# Altium schematic sheet E-15 ENET2.SchDoc: FRDM-IMX93
size 513 x 386 mm; DrawnBy: FORLINX; Organization: ORGANIZATION; Address1: ADDRESS 1; Address2: ADDRESS 2; Address3: ADDRESS 3; Address4: ADDRESS 4; Revision: -; ENG_APP_DATE: --/--/--; DSN_APP_DATE: --/--/--; CHK_APP_DATE: --/--/--; Classification: Public, Company Internal/Proprietary, Company Confidential,  Company Secret; Page Create Date: March  8, 1995; OrgName: NXP Semiconductor; FIUO: A; OrgAddr1: NO. 192 Liangjing Rd. Pudong New Area, ShangHai; Page Number: 15; PageTitle: ENET2; Page Size: C; Page Count: 23; Designer: FORLINX; RevCode: B1; Approver: NXP SE; Doc: SCH-94611 PDF: SPF-94611; DsnPath: T:\FILES\Designs\Single Board Computers\i.MX93-FRDM\Design Files\SCH-94611_B1.DSN; SchematicName: FRDM-i.MX 93 Development Board; PageName: E-15 ENET2; PageSize: C; TopSchematic: True
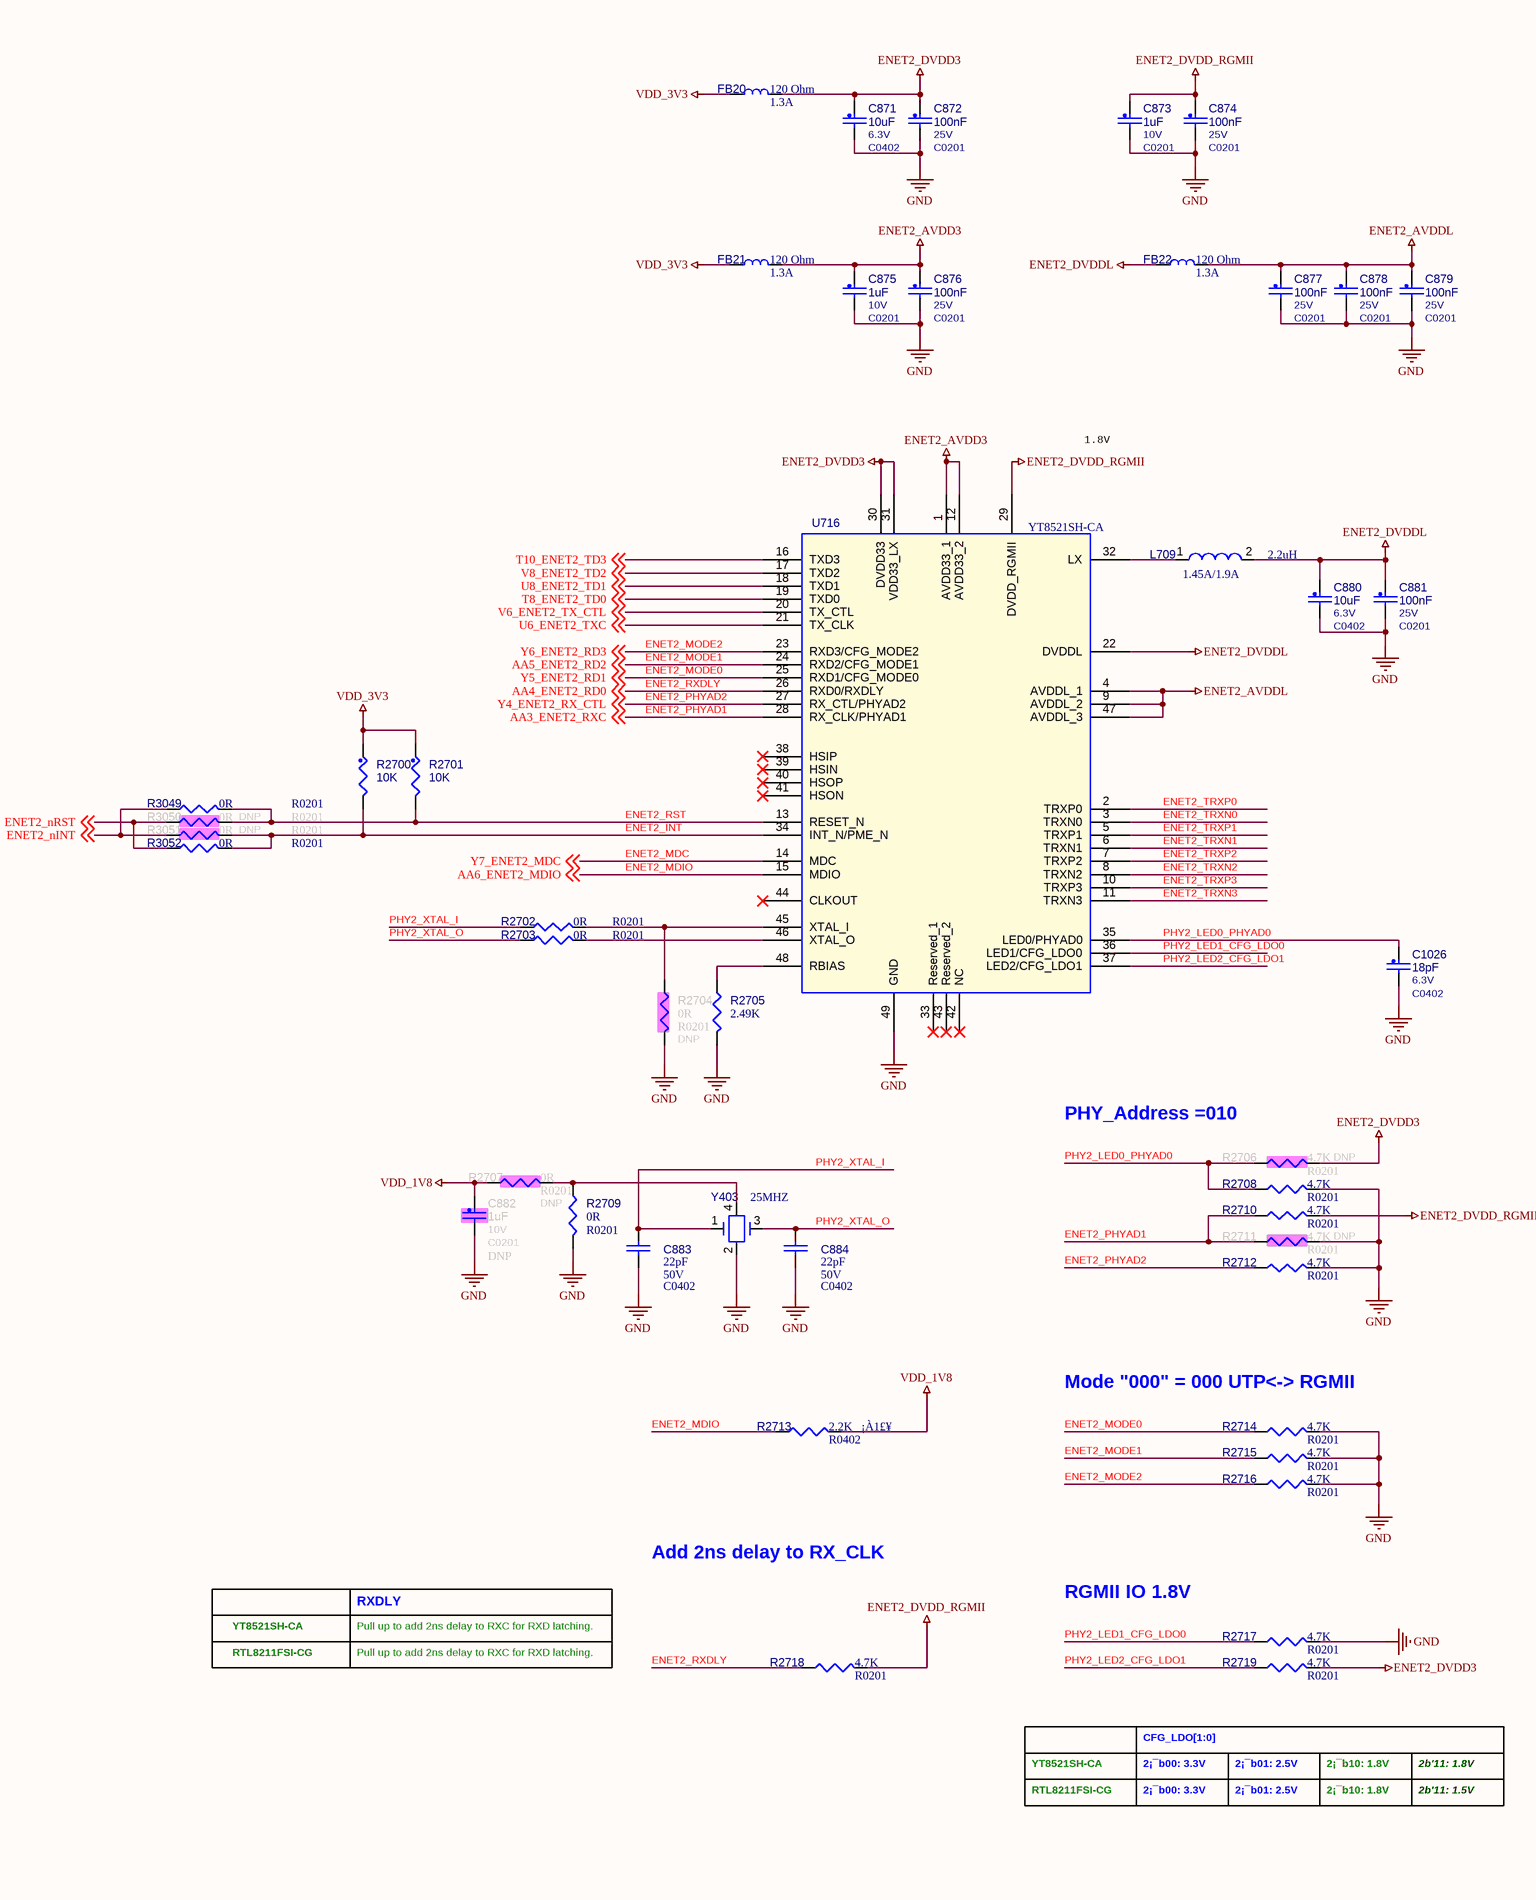
[diagram p0: E-15 ENET2.SchDoc, left]
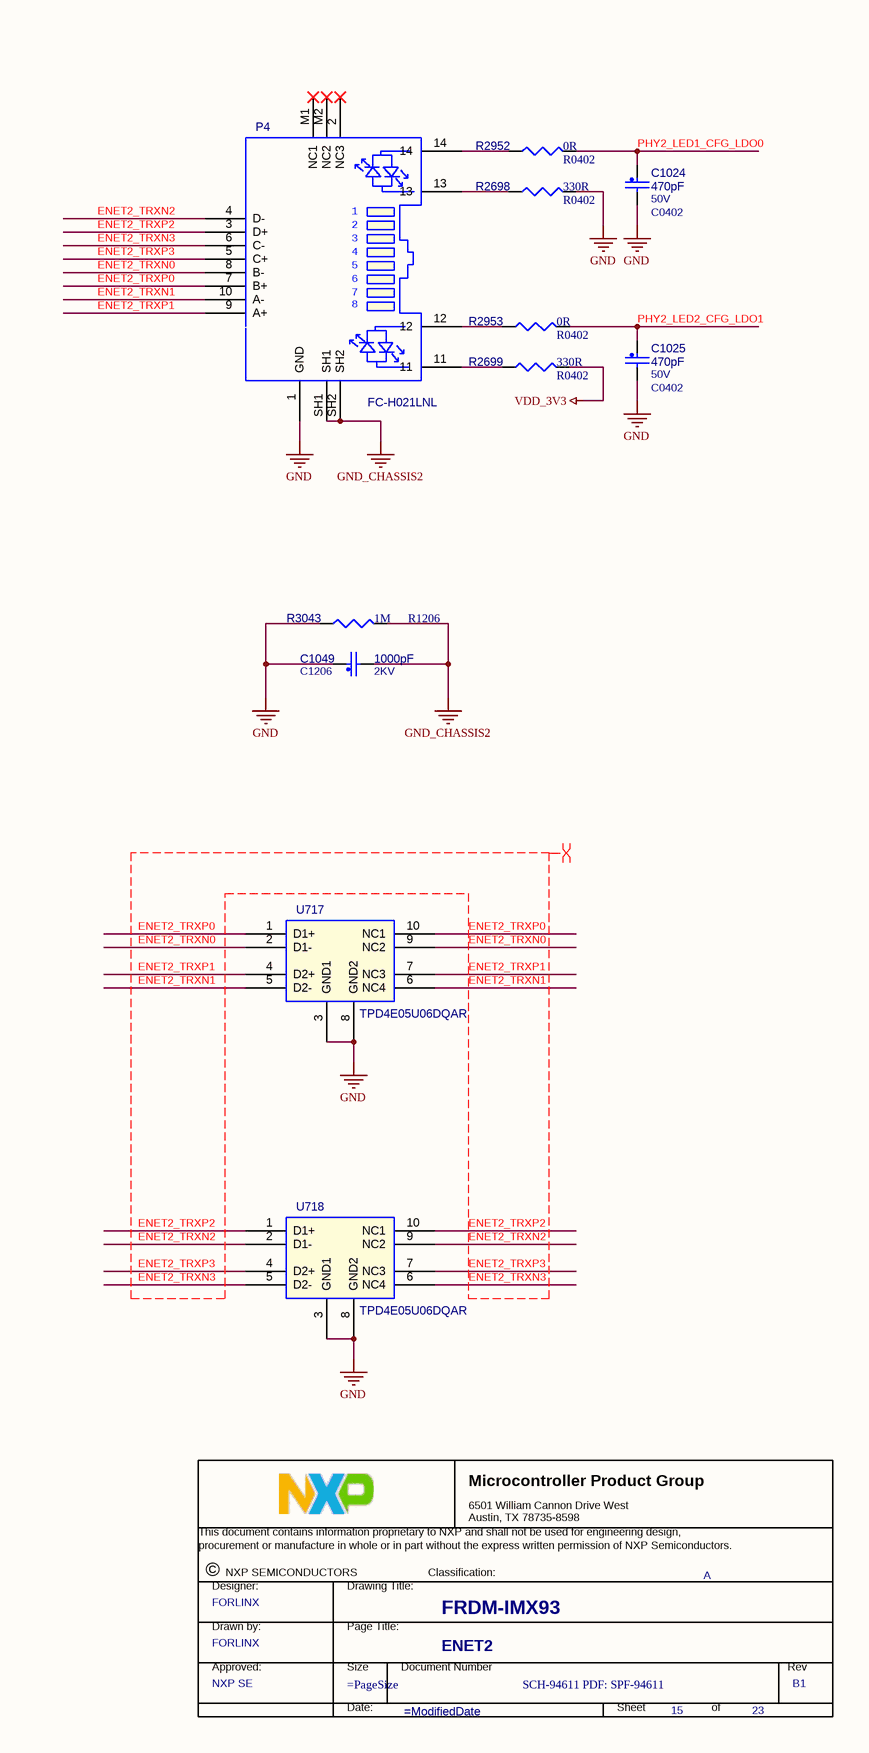
[diagram p1: E-15 ENET2.SchDoc, right]

## Parts
*  Title: FRDM-IMX93  RevCode: B1  PageTitle: ENET2  Page Number: 15  Page Count: 23  DrawnBy: FORLINX  Doc: SCH-94611 PDF: SPF-94611  Approver: NXP SE  FIUO: A  (graphical)
C871  10uF  VOLTAGE: 6.3V  [C0402]
C872  100nF  VOLTAGE: 25V  [C0201]
C873  1uF  VOLTAGE: 10V  [C0201]
C874  100nF  VOLTAGE: 25V  [C0201]
C875  1uF  VOLTAGE: 10V  [C0201]
C876  100nF  VOLTAGE: 25V  [C0201]
C877  100nF  VOLTAGE: 25V  [C0201]
C878  100nF  VOLTAGE: 25V  [C0201]
C879  100nF  VOLTAGE: 25V  [C0201]
C880  10uF  VOLTAGE: 6.3V  [C0402]
C881  100nF  VOLTAGE: 25V  [C0201]
C882  1uF  ASSY_OPT: DNP  VOLTAGE: 10V  [C0201]
C883  22pF  Voltage: 50V  [C0402]
C884  22pF  Voltage: 50V  [C0402]
C1024  470pF  VOLTAGE: 50V  [C0402]
C1025  470pF  VOLTAGE: 50V  [C0402]
C1026  18pF  VOLTAGE: 6.3V  [C0402]
C1049  1000pF  VOLTAGE: 2KV  [C1206]
FB20  120 Ohm  electric current: 1.3A  [FB0402]
FB21  120 Ohm  electric current: 1.3A  [FB0402]
FB22  120 Ohm  electric current: 1.3A  [FB0402]
L709  2.2uH  electric current: 1.45A/1.9A  [IND_2016A]
P4  FC-H021LNL  [RJ45-Gigabit]
R2698  330R  [R0402]
R2699  330R  [R0402]
R2700  10K  [R0201]
R2701  10K  [R0201]
R2702  0R  [R0201]
R2703  0R  [R0201]
R2704  0R  ASSY_OPT: DNP  [R0201]
R2705  2.49K  [R0402]
R2706  4.7K  ASSY_OPT: DNP  [R0201]
R2707  0R  ASSY_OPT: DNP  [R0201]
R2708  4.7K  [R0201]
R2709  0R  [R0201]
R2710  4.7K  [R0201]
R2711  4.7K  ASSY_OPT: DNP  [R0201]
R2712  4.7K  [R0201]
R2713  2.2K  precision: ¡À1£¥  [R0402]
R2714  4.7K  [R0201]
R2715  4.7K  [R0201]
R2716  4.7K  [R0201]
R2717  4.7K  [R0201]
R2718  4.7K  [R0201]
R2719  4.7K  [R0201]
R2952  0R  [R0402]
R2953  0R  [R0402]
R3043  1M  [R1206]
R3049  0R  [R0201]
R3050  0R  ASSY_OPT: DNP  [R0201]
R3051  0R  ASSY_OPT: DNP  [R0201]
R3052  0R  [R0201]
U716  YT8521SH-CA  [QFN48P_0_4BSC_6x6_H]
U717  TPD4E05U06DQAR  [USON-10]
U718  TPD4E05U06DQAR  [USON-10]
Y403  25MHZ  [xtlosc4_3p2x2p5mm_sm]

## Nets
ENET2_AVDD3: C875.1 C876.1 FB21.2 U716.1(AVDD33_1) U716.12(AVDD33_2)
ENET2_AVDDL: C877.1 C878.1 C879.1 FB22.2 U716.4(AVDDL_1) U716.9(AVDDL_2) U716.47(AVDDL_3)
ENET2_DVDD3: C871.1 C872.1 FB20.2 R2706.2 R2719.2 U716.30(DVDD33) U716.31(VDD33_LX)
ENET2_DVDD_RGMII: C873.1 C874.1 R2710.2 R2718.2 U716.29(DVDD_RGMII)
ENET2_DVDDL: C880.1 C881.1 FB22.1 L709.2 U716.22(DVDDL)
GND: C871.2 C872.2 C873.2 C874.2 C875.2 C876.2 C877.2 C878.2 C879.2 C880.2 C881.2 C882.2 C883.2 C884.2 C1024.2 C1025.2 C1026.2 C1049.1 P4.1(GND) R2698.2 R2704.2 R2705.2 R2708.2 R2709.2 R2711.2 R2712.2 R2714.2 R2715.2 R2716.2 R2717.2 R3043.1 U716.49(GND) U717.3(GND1) U717.8(GND2) U718.3(GND1) U718.8(GND2) Y403.2
GND_CHASSIS2: C1049.2 P4.SH1 P4.SH2 R3043.2
VDD_1V8: C882.1 R2707.1 R2713.2
VDD_3V3: FB20.1 FB21.1 R2699.2 R2700.1 R2701.1
ENET2_INT: R2700.2 R3051.2 R3052.2 U716.34(INT_N/PME_N)
ENET2_MDC: U716.14(MDC) ; off-sheet Y7_ENET2_MDC  [also labelled Y7_ENET2_MDC]
ENET2_MDIO: R2713.1 U716.15(MDIO) ; off-sheet AA6_ENET2_MDIO  [also labelled AA6_ENET2_MDIO]
ENET2_MODE0: R2714.1 U716.25(RXD1/CFG_MODE0) ; off-sheet Y5_ENET2_RD1  [also labelled Y5_ENET2_RD1]
ENET2_MODE1: R2715.1 U716.24(RXD2/CFG_MODE1) ; off-sheet AA5_ENET2_RD2  [also labelled AA5_ENET2_RD2]
ENET2_MODE2: R2716.1 U716.23(RXD3/CFG_MODE2) ; off-sheet Y6_ENET2_RD3  [also labelled Y6_ENET2_RD3]
ENET2_nINT: R3049.1 R3051.1 ; off-sheet ENET2_nINT
ENET2_nRST: R3050.1 R3052.1 ; off-sheet ENET2_nRST
ENET2_PHYAD1: R2710.1 R2711.1 U716.28(RX_CLK/PHYAD1) ; off-sheet AA3_ENET2_RXC  [also labelled AA3_ENET2_RXC]
ENET2_PHYAD2: R2712.1 U716.27(RX_CTL/PHYAD2) ; off-sheet Y4_ENET2_RX_CTL  [also labelled Y4_ENET2_RX_CTL]
ENET2_RST: R2701.2 R3049.2 R3050.2 U716.13(RESET_N)
ENET2_RXDLY: R2718.1 U716.26(RXD0/RXDLY) ; off-sheet AA4_ENET2_RD0  [also labelled AA4_ENET2_RD0]
ENET2_TRXN0: P4.8(B-) U716.3(TRXN0) U717.2(D1-) U717.9(NC2)
ENET2_TRXN1: P4.10(A-) U716.6(TRXN1) U717.5(D2-) U717.6(NC4)
ENET2_TRXN2: P4.4(D-) U716.8(TRXN2) U718.2(D1-) U718.9(NC2)
ENET2_TRXN3: P4.6(C-) U716.11(TRXN3) U718.5(D2-) U718.6(NC4)
ENET2_TRXP0: P4.7(B+) U716.2(TRXP0) U717.1(D1+) U717.10(NC1)
ENET2_TRXP1: P4.9(A+) U716.5(TRXP1) U717.4(D2+) U717.7(NC3)
ENET2_TRXP2: P4.3(D+) U716.7(TRXP2) U718.1(D1+) U718.10(NC1)
ENET2_TRXP3: P4.5(C+) U716.10(TRXP3) U718.4(D2+) U718.7(NC3)
PHY2_LED0_PHYAD0: C1026.1 R2706.1 R2708.1 U716.35(LED0/PHYAD0)
PHY2_LED1_CFG_LDO0: C1024.1 R2717.1 R2952.2 U716.36(LED1/CFG_LDO0)
PHY2_LED2_CFG_LDO1: C1025.1 R2719.1 R2953.2 U716.37(LED2/CFG_LDO1)
PHY2_XTAL_I: C883.1 R2702.1 Y403.1
PHY2_XTAL_O: C884.1 R2703.1 Y403.3
T8_ENET2_TD0: U716.19(TXD0) ; off-sheet T8_ENET2_TD0
T10_ENET2_TD3: U716.16(TXD3) ; off-sheet T10_ENET2_TD3
U6_ENET2_TXC: U716.21(TX_CLK) ; off-sheet U6_ENET2_TXC
U8_ENET2_TD1: U716.18(TXD1) ; off-sheet U8_ENET2_TD1
V6_ENET2_TX_CTL: U716.20(TX_CTL) ; off-sheet V6_ENET2_TX_CTL
V8_ENET2_TD2: U716.17(TXD2) ; off-sheet V8_ENET2_TD2
NetL709_1: L709.1 U716.32(LX)
NetP4_11: P4.11 R2699.1
NetP4_12: P4.12 R2953.1
NetP4_13: P4.13 R2698.1
NetP4_14: P4.14 R2952.1
NetR2702_2: R2702.2 R2704.1 U716.45(XTAL_I)
NetR2703_2: R2703.2 U716.46(XTAL_O)
NetR2705_1: R2705.1 U716.48(RBIAS)
NetR2707_2: R2707.2 R2709.1 Y403.4

Not connected (* = marked no-connect by the designer): P4 2(NC3)* M1(NC1)* M2(NC2)*; U716 33(Reserved_1)* 38(HSIP)* 39(HSIN)* 40(HSOP)* 41(HSON)* 42(NC)* 43(Reserved_2)* 44(CLKOUT)*

## Layout directives
differential pair: ENET2_TRXN0, ENET2_TRXN1, ENET2_TRXN2, ENET2_TRXN3, ENET2_TRXP0, ENET2_TRXP1, ENET2_TRXP2, ENET2_TRXP3

## Notes on the sheet
- 1.8V
- PHY_Address =010
- (near R2714) Mode "000" = 000 UTP<-> RGMII
- Add 2ns delay to RX_CLK
- YT8521SH-CA
- Pull up to add 2ns delay to RXC for RXD latching.
- RXDLY
- RGMII IO 1.8V
- RTL8211FSI-CG
- 2¡¯b00: 3.3V
- CFG_LDO[1:0]
- 2¡¯b01: 2.5V
- 2¡¯b10: 1.8V
- 2b'11: 1.8V
- 2b'11: 1.5V
- DWG. NO.
- REV.
- SHT.
- REVISION
- DESCRIPTION
- DATE
- APPROVED
- ENG:
- APPROVALS
- quilter.ai <http://quilter.ai>
- DSN:
- CHK:
- REFERENCE DOCUMENTS
- TITLE
- PROJECT
- BOM:
- FAB DWG:
- PCB DWG:
- ASSY DWG:
- SIZE
- FILE NAME
- C
- DWG NO.
- SHEET
- OF
- REV
- (in symbol TitleBlock_MCPG) Microcontroller Product Group; 6501 William Cannon Drive West / Austin, TX 78735-8598; This document contains information proprietary to NXP and shall not be used for engineering design,; procurement or manufacture in whole or in part without the express written permission of NXP Semiconductors.; ©; NXP SEMICONDUCTORS; Classification:; Designer:; Drawing Title:; Drawn by:; Page Title:; Approved:; Size; Document Number; Rev; Date:; Sheet; of

## Library data of the parts
* = TitleBlock_MCPG: Classification: Public, Company Internal/Proprietary, Company Confidential,  Company Secret; OrgName: NXP Semiconductor; OrgAddr1: NO. 192 Liangjing Rd. Pudong New Area, ShangHai; Page Size: =PageSize; Page Create Date: March  8, 1995; Designer: FORLINX; Page Modify Date: =ModifiedDate
C871 = CAP_NP: 0402,10uF,6.3V,+/-20%,X5R; Part Reference: C871; CLASS: DISCRETE; Tolerance: 20%; MFG_NAME01: FENGHUA; MFG_PN01: 0402X106M6R3NT; CAD_APPROVED: Yes; FPLIST: CC0402_25,CC0402_HD,0402_CC; Value: 10uF; ROHS: Yes; HEIGHT: 0.65 MM; PCB Footprint: C0402
C872 = CAP_NP: 0201,100nF,25V,+/-10%,X5R; Part Reference: C872; CLASS: DISCRETE; FPLIST: CC0402_25,CC0402_HD,0402_CC; CAD_APPROVED: Yes; MFG_PN01: 0201X104K250NT; MFG_NAME01: FENGHUA; Tolerance: 20%; Value: 100nF; HEIGHT: 0.65 MM; ROHS: Yes; PCB Footprint: C0201
C873 = CAP_NP: 0201,1uF,10V,+/-20%,X5R; Part Reference: C873; CLASS: DISCRETE; FPLIST: CC0201,CC0201_HD,0201_CC,0201_CC_012SM_NSP; CAD_APPROVED: Yes; MFG_PN01: CL03A105MP3NSNC; MFG_NAME01: SAMSUNG; Tolerance: 20%; Value: 1uF; Package Type: 7¡± reel; Package Size: 0201; HEIGHT: 0.35MM; ROHS: Yes; PCB Footprint: C0201
C874 = CAP_NP: 0201,100nF,25V,+/-10%,X5R; Part Reference: C874; CLASS: DISCRETE; Tolerance: 20%; MFG_NAME01: FENGHUA; MFG_PN01: 0201X104K250NT; CAD_APPROVED: Yes; FPLIST: CC0402_25,CC0402_HD,0402_CC; Value: 100nF; ROHS: Yes; HEIGHT: 0.65 MM; PCB Footprint: C0201
C875 = CAP_NP: 0201,1uF,10V,+/-20%,X5R; Part Reference: C875; CLASS: DISCRETE; Tolerance: 20%; MFG_NAME01: SAMSUNG; MFG_PN01: CL03A105MP3NSNC; CAD_APPROVED: Yes; FPLIST: CC0201,CC0201_HD,0201_CC,0201_CC_012SM_NSP; Value: 1uF; ROHS: Yes; HEIGHT: 0.35MM; Package Size: 0201; Package Type: 7¡± reel; PCB Footprint: C0201
C876 = CAP_NP: 0201,100nF,25V,+/-10%,X5R; Part Reference: C876; CLASS: DISCRETE; FPLIST: CC0402_25,CC0402_HD,0402_CC; CAD_APPROVED: Yes; MFG_PN01: 0201X104K250NT; MFG_NAME01: FENGHUA; Tolerance: 20%; Value: 100nF; HEIGHT: 0.65 MM; ROHS: Yes; PCB Footprint: C0201
C877 = CAP_NP: 0201,100nF,25V,+/-10%,X5R; Part Reference: C877; CLASS: DISCRETE; FPLIST: CC0402_25,CC0402_HD,0402_CC; CAD_APPROVED: Yes; MFG_PN01: 0201X104K250NT; MFG_NAME01: FENGHUA; Tolerance: 20%; Value: 100nF; HEIGHT: 0.65 MM; ROHS: Yes; PCB Footprint: C0201
C878 = CAP_NP: 0201,100nF,25V,+/-10%,X5R; Part Reference: C878; CLASS: DISCRETE; FPLIST: CC0402_25,CC0402_HD,0402_CC; CAD_APPROVED: Yes; MFG_PN01: 0201X104K250NT; MFG_NAME01: FENGHUA; Tolerance: 20%; Value: 100nF; HEIGHT: 0.65 MM; ROHS: Yes; PCB Footprint: C0201
C879 = CAP_NP: 0201,100nF,25V,+/-10%,X5R; Part Reference: C879; CLASS: DISCRETE; Tolerance: 20%; MFG_NAME01: FENGHUA; MFG_PN01: 0201X104K250NT; CAD_APPROVED: Yes; FPLIST: CC0402_25,CC0402_HD,0402_CC; Value: 100nF; ROHS: Yes; HEIGHT: 0.65 MM; PCB Footprint: C0201
C880 = CAP_NP: 0402,10uF,6.3V,+/-20%,X5R; Part Reference: C880; CLASS: DISCRETE; Tolerance: 20%; MFG_NAME01: FENGHUA; MFG_PN01: 0402X106M6R3NT; CAD_APPROVED: Yes; FPLIST: CC0402_25,CC0402_HD,0402_CC; Value: 10uF; ROHS: Yes; HEIGHT: 0.65 MM; PCB Footprint: C0402
C881 = CAP_NP: 0201,100nF,25V,+/-10%,X5R; Part Reference: C881; CLASS: DISCRETE; Tolerance: 20%; MFG_NAME01: FENGHUA; MFG_PN01: 0201X104K250NT; CAD_APPROVED: Yes; FPLIST: CC0402_25,CC0402_HD,0402_CC; Value: 100nF; ROHS: Yes; HEIGHT: 0.65 MM; PCB Footprint: C0201
C882 = CAP_NP: 0201,1uF,10V,+/-20%,X5R; Part Reference: C882; CLASS: DISCRETE; Tolerance: 20%; MFG_NAME01: SAMSUNG; MFG_PN01: CL03A105MP3NSNC; CAD_APPROVED: Yes; FPLIST: CC0201,CC0201_HD,0201_CC,0201_CC_012SM_NSP; Value: 1uF; ROHS: Yes; HEIGHT: 0.35MM; Package Size: 0201; Package Type: 7¡± reel; PCB Footprint: C0201
C883 = C0402,22pF: 0402,22pF,50V,+/-5%,NPO; Part Reference: C883; serial number: 1110202003; MFG_NAME01: FENGHUA; MFG_PN01: 0402CG220J500NT; PCB Footprint: C0402; Value: 22pF
C884 = C0402,22pF: 0402,22pF,50V,+/-5%,NPO; Part Reference: C884; serial number: 1110202003; MFG_NAME01: FENGHUA; MFG_PN01: 0402CG220J500NT; PCB Footprint: C0402; Value: 22pF
C1024 = CAP_NP: 0402,470pF,50V,+/-5%,NPO; Part Reference: C1024; CLASS: DISCRETE; Tolerance: 20%; MFG_NAME01: FENGHUA; MFG_PN01: 0402CG471J500NT; CAD_APPROVED: Yes; FPLIST: CC0402_25,CC0402_HD,0402_CC; Value: 470pF; ROHS: Yes; HEIGHT: 0.65 MM; PCB Footprint: C0402
C1025 = CAP_NP: 0402,470pF,50V,+/-5%,NPO; Part Reference: C1025; CLASS: DISCRETE; FPLIST: CC0402_25,CC0402_HD,0402_CC; CAD_APPROVED: Yes; MFG_PN01: 0402CG471J500NT; MFG_NAME01: FENGHUA; Tolerance: 20%; Value: 470pF; HEIGHT: 0.65 MM; ROHS: Yes; PCB Footprint: C0402
C1026 = CAP_NP: 0402,18pF,50V,+/-5%,NPO; Part Reference: C1026; CLASS: DISCRETE; Tolerance: 20%; MFG_NAME01: FENGHUA; MFG_PN01: 0402B103K500NT; CAD_APPROVED: Yes; FPLIST: CC0402_25,CC0402_HD,0402_CC; Value: 18pF; ROHS: Yes; HEIGHT: 0.65 MM; PCB Footprint: C0402
C1049 = CAP_NP: 1206,1nF,2KV,+/-10%; Part Reference: C1049; CLASS: DISCRETE; Tolerance: 20%; MFG_NAME01: FENGHUA; MFG_PN01: 1206B102K202NT; CAD_APPROVED: Yes; FPLIST: CC0402_25,CC0402_HD,0402_CC; Value: 1000pF; ROHS: Yes; HEIGHT: 0.65 MM; PCB Footprint: C1206
FB20 = FB0402,120ohm,1.3A: 0402,120Ohm@100MHz,2A; Part Reference: FB20; serial number: 1110304038; MFG_NAME01: Murata; MFG_PN01: BLM15PX121SN1D; PCB Footprint: FB0402; Value: 120 Ohm
FB21 = FB0402,120ohm,1.3A: 0402,120Ohm@100MHz,2A; Part Reference: FB21; serial number: 1110304038; MFG_NAME01: Murata; MFG_PN01: BLM15PX121SN1D; PCB Footprint: FB0402; Value: 120 Ohm
FB22 = FB0402,120ohm,1.3A: 0402,120Ohm@100MHz,2A; Part Reference: FB22; serial number: 1110304038; MFG_NAME01: Murata; MFG_PN01: BLM15PX121SN1D; PCB Footprint: FB0402; Value: 120 Ohm
L709 = INDUCTOR-WPN201612HR47MT: 2.2uH,2*1.6*1mm,2.15A; Part Reference: L709; serial number: 1110301115; MFG_NAME01: Sunlord; MFG_PN01: WPN201610H2R2MT; Value: 2.2uH; PCB Footprint: IND_2016A
P4 = FC-H021LNL_0: HR851178A,RJ45,1000M; Part Reference: P4; MFG_NAME01: Hanrun; Value: FC-H021LNL; MFG_PN01: HR851178A; PCB Footprint: RJ45-Gigabit
R2698 = R0402,4.7K_Dup1: 0402,330Ohm,+/-1%; Part Reference: R2698; precision: ¡À1£¥; serial number: 1110102015; MFG_NAME01: FENGHUA; MFG_PN01: RC-02W3300FT; PCB Footprint: R0402; Value: 330R
R2699 = R0402,4.7K_Dup1: 0402,330Ohm,+/-1%; Part Reference: R2699; precision: ¡À1£¥; serial number: 1110102015; MFG_NAME01: FENGHUA; MFG_PN01: RC-02W3300FT; PCB Footprint: R0402; Value: 330R
R2700 = RES: 0201,10K,+/-5%; Part Reference: R2700; CLASS: DISCRETE; TOL: 5%; MFG_NAME01: FENGHUA; MFG_PN01: RC-01W103JT; CAD_APPROVED: Yes; FPLIST: RC0402_25,RC0402_HD,RC0402_X2,0402_CC,CAPC0402_L; Value: 10K; HEIGHT: 0.41mm; Tolerance: 5%; ROHS: Yes; PCB Footprint: R0201
R2701 = RES: 0201,10K,+/-5%; Part Reference: R2701; CLASS: DISCRETE; TOL: 5%; MFG_NAME01: FENGHUA; MFG_PN01: RC-01W103JT; CAD_APPROVED: Yes; FPLIST: RC0402_25,RC0402_HD,RC0402_X2,0402_CC,CAPC0402_L; Value: 10K; HEIGHT: 0.41mm; Tolerance: 5%; ROHS: Yes; PCB Footprint: R0201
R2702 = R0402,1.5K: 0201,0Ohm,+/-5%; Part Reference: R2702; serial number: 1110102060; precision: ¡À1£¥; MFG_NAME01: FENGHUA; MFG_PN01: RC-01000JT; PCB Footprint: R0201; Value: 0R
R2703 = R0402,1.5K: 0201,0Ohm,+/-5%; Part Reference: R2703; serial number: 1110102060; precision: ¡À1£¥; MFG_NAME01: FENGHUA; MFG_PN01: RC-01000JT; PCB Footprint: R0201; Value: 0R
R2704 = R0402,1.5K: 0201,0Ohm,+/-5%; Part Reference: R2704; serial number: 1110102060; precision: ¡À1£¥; MFG_PN01: RC-01000JT; MFG_NAME01: FENGHUA; PCB Footprint: R0201; Value: 0R
R2705 = R0402,2.49K: 0402,2.49K,+/-1%; Part Reference: R2705; precision: ¡À1£¥; serial number: 1110102182; MFG_NAME01: FENGHUA; MFG_PN01: RC-02W2491FT; PCB Footprint: R0402; Value: 2.49K
R2706 = R0402,4.7K_Dup1: 0201,4.7K,+/-1%; Part Reference: R2706; precision: ¡À1£¥; serial number: 1110102015; MFG_NAME01: FENGHUA; MFG_PN01: RC-01W4701FT; PCB Footprint: R0201; Value: 4.7K
R2707 = R0402,1.5K: 0201,0Ohm,+/-5%; Part Reference: R2707; serial number: 1110102060; precision: ¡À1£¥; MFG_NAME01: FENGHUA; MFG_PN01: RC-01000JT; PCB Footprint: R0201; Value: 0R
R2708 = R0402,4.7K_Dup1: 0201,4.7K,+/-1%; Part Reference: R2708; precision: ¡À1£¥; serial number: 1110102015; MFG_NAME01: FENGHUA; MFG_PN01: RC-01W4701FT; PCB Footprint: R0201; Value: 4.7K
R2709 = R0402,1.5K: 0201,0Ohm,+/-5%; Part Reference: R2709; serial number: 1110102060; precision: ¡À1£¥; MFG_NAME01: FENGHUA; MFG_PN01: RC-01000JT; PCB Footprint: R0201; Value: 0R
R2710 = R0402,4.7K_Dup1: 0201,4.7K,+/-1%; Part Reference: R2710; precision: ¡À1£¥; serial number: 1110102015; MFG_NAME01: FENGHUA; MFG_PN01: RC-01W4701FT; PCB Footprint: R0201; Value: 4.7K
R2711 = R0402,4.7K_Dup1: 0201,4.7K,+/-1%; Part Reference: R2711; precision: ¡À1£¥; serial number: 1110102015; MFG_NAME01: FENGHUA; MFG_PN01: RC-01W4701FT; PCB Footprint: R0201; Value: 4.7K
R2712 = R0402,4.7K_Dup1: 0201,4.7K,+/-1%; Part Reference: R2712; precision: ¡À1£¥; serial number: 1110102015; MFG_NAME01: FENGHUA; MFG_PN01: RC-01W4701FT; PCB Footprint: R0201; Value: 4.7K
R2713 = R0402,1.5K: 0402,2.2K,+/-1%; Part Reference: R2713; serial number: 1110102060; MFG_NAME01: FENGHUA; MFG_PN01: RC-02K2201FT; PCB Footprint: R0402; Value: 2.2K
R2714 = R0402,4.7K_Dup1: 0201,4.7K,+/-1%; Part Reference: R2714; precision: ¡À1£¥; serial number: 1110102015; MFG_NAME01: FENGHUA; MFG_PN01: RC-01W4701FT; PCB Footprint: R0201; Value: 4.7K
R2715 = R0402,4.7K_Dup1: 0201,4.7K,+/-1%; Part Reference: R2715; precision: ¡À1£¥; serial number: 1110102015; MFG_NAME01: FENGHUA; MFG_PN01: RC-01W4701FT; PCB Footprint: R0201; Value: 4.7K
R2716 = R0402,4.7K_Dup1: 0201,4.7K,+/-1%; Part Reference: R2716; precision: ¡À1£¥; serial number: 1110102015; MFG_NAME01: FENGHUA; MFG_PN01: RC-01W4701FT; PCB Footprint: R0201; Value: 4.7K
R2717 = R0402,4.7K_Dup1: 0201,4.7K,+/-1%; Part Reference: R2717; precision: ¡À1£¥; serial number: 1110102015; MFG_NAME01: FENGHUA; MFG_PN01: RC-01W4701FT; PCB Footprint: R0201; Value: 4.7K
R2718 = R0402,4.7K_Dup1: 0201,4.7K,+/-1%; Part Reference: R2718; precision: ¡À1£¥; serial number: 1110102015; MFG_NAME01: FENGHUA; MFG_PN01: RC-01W4701FT; PCB Footprint: R0201; Value: 4.7K
R2719 = R0402,4.7K_Dup1: 0201,4.7K,+/-1%; Part Reference: R2719; precision: ¡À1£¥; serial number: 1110102015; MFG_NAME01: FENGHUA; MFG_PN01: RC-01W4701FT; PCB Footprint: R0201; Value: 4.7K
R2952 = R0402,4.7K_Dup1: 0402,0Ohm,+/-1%; Part Reference: R2952; precision: ¡À1£¥; serial number: 1110102015; MFG_NAME01: FENGHUA; MFG_PN01: RC-02000FT; PCB Footprint: R0402; Value: 0R
R2953 = R0402,4.7K_Dup1: 0402,0Ohm,+/-1%; Part Reference: R2953; precision: ¡À1£¥; serial number: 1110102015; MFG_NAME01: FENGHUA; MFG_PN01: RC-02000FT; PCB Footprint: R0402; Value: 0R
R3043 = R0402,4.7K_Dup1: 1206,1M,+/-5%; Part Reference: R3043; precision: ¡À1£¥; serial number: 1110102015; MFG_NAME01: FENGHUA; MFG_PN01: RS-06K105JT; PCB Footprint: R1206; Value: 1M
R3049 = R0402,1.5K: 0201,0Ohm,+/-5%; Part Reference: R3049; serial number: 1110102060; precision: ¡À1£¥; MFG_NAME01: FENGHUA; MFG_PN01: RC-01000JT; PCB Footprint: R0201; Value: 0R
R3050 = R0402,1.5K: 0201,0Ohm,+/-5%; Part Reference: R3050; serial number: 1110102060; precision: ¡À1£¥; MFG_NAME01: FENGHUA; MFG_PN01: RC-01000JT; PCB Footprint: R0201; Value: 0R
R3051 = R0402,1.5K: 0201,0Ohm,+/-5%; Part Reference: R3051; serial number: 1110102060; precision: ¡À1£¥; MFG_PN01: RC-01000JT; MFG_NAME01: FENGHUA; PCB Footprint: R0201; Value: 0R
R3052 = R0402,1.5K: 0201,0Ohm,+/-5%; Part Reference: R3052; serial number: 1110102060; precision: ¡À1£¥; MFG_NAME01: FENGHUA; MFG_PN01: RC-01000JT; PCB Footprint: R0201; Value: 0R
U716 = YT8521SH-CA: Part Reference: U716; MFG_NAME01: MotorComm; Value: YT8521SH-CA; MFG_PN01: YT8521SH-CA; PCB Footprint: QFN48P_0_4BSC_6x6_H
U717 = TPD4E05U06DQAR_8: TPD4E05U06DQAR,USON; Part Reference: U717; MFG_NAME01: TI; Value: TPD4E05U06DQAR; MFG_PN01: TPD4E05U06DQAR; PCB Footprint: USON-10
U718 = TPD4E05U06DQAR_9: TPD4E05U06DQAR,USON; Part Reference: U718; MFG_NAME01: TI; Value: TPD4E05U06DQAR; MFG_PN01: TPD4E05U06DQAR; PCB Footprint: USON-10
Y403 = CRYSTAL_4P-TSX-3225: Crystal,25MHZ,4P,3.2*2.5mm,+/-20ppm,20pf; Part Reference: Y403; serial number: 1110601039; MFG_NAME01: Dongxin Hengke; MFG_PN01: SE25000O33D; Value: 25MHZ; PCB Footprint: xtlosc4_3p2x2p5mm_sm